# Altium schematic sheet schematic.SchDoc: <Project Name>
size A4; ENG_APP_DATE: --/--/--; DSN_APP_DATE: --/--/--; CHK_APP_DATE: --/--/--; Engineer: Engineer; Address4: Thành phố Hồ Chí Minh; DocumentNumber: 1; Revision: 1.0; SheetNumber: 1; SheetTotal: 1
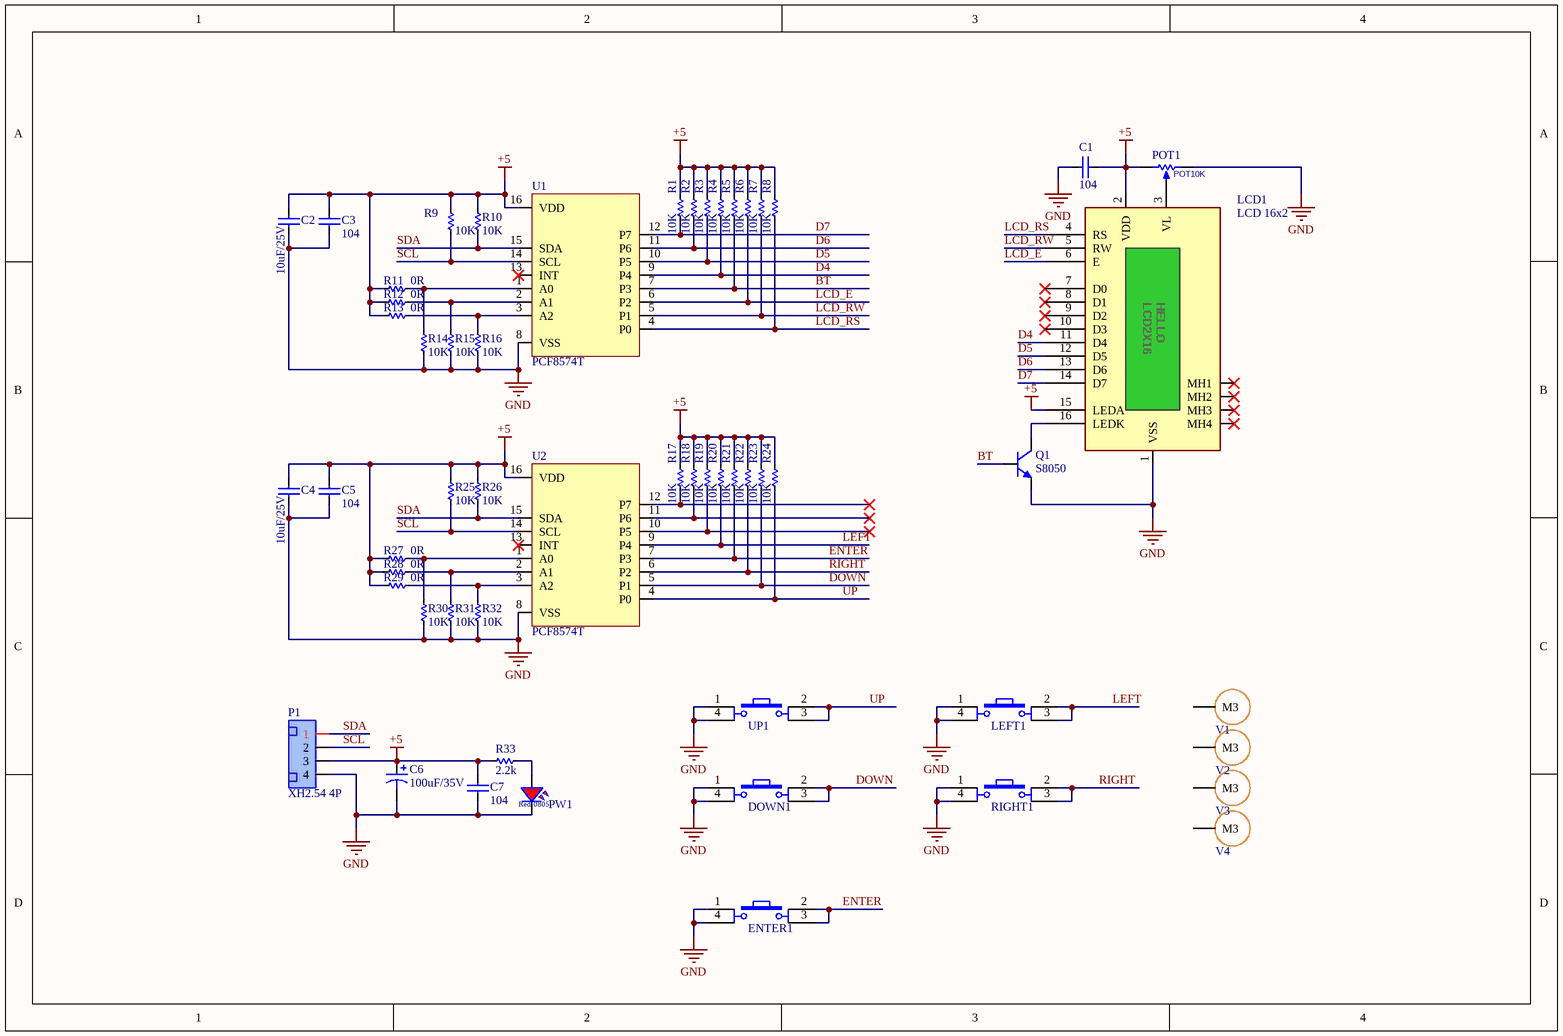
[diagram p0: schematic.SchDoc]

## Parts
C1  104  [C_0805_SMD]
C2  10uF/25V  [C_0805_SMD]
C3  104  [C_0805_SMD]
C4  10uF/25V  [C_0805_SMD]
C5  104  [C_0805_SMD]
C6  100uF/35V  [C_6.3x12]
C7  104  [C_0805_SMD]
DOWN1  SW4  [TSW DIP-12*12*17]  (value not drawn)
ENTER1  SW4  [TSW DIP-12*12*17]  (value not drawn)
LCD1  LCD 16x2  [LCD_16x2]
LEFT1  SW4  [TSW DIP-12*12*17]  (value not drawn)
P1  XH2.54 4P  [XH2.54_4P_RA]
POT1  POT10K  [POT_3362H]
PW1  LED RED  [LED 0805 Red]  (value not drawn)
Q1  S8050  [SOT23_N NXP]
R1  10K  [RES-SMD-0805]
R2  10K  [RES-SMD-0805]
R3  10K  [RES-SMD-0805]
R4  10K  [RES-SMD-0805]
R5  10K  [RES-SMD-0805]
R6  10K  [RES-SMD-0805]
R7  10K  [RES-SMD-0805]
R8  10K  [RES-SMD-0805]
R9  10K  [RES-SMD-0805]
R10  10K  [RES-SMD-0805]
R11  0R  [RES-SMD-0603]
R12  0R  [RES-SMD-0603]
R13  0R  [RES-SMD-0603]
R14  10K  [RES-SMD-0805]
R15  10K  [RES-SMD-0805]
R16  10K  [RES-SMD-0805]
R17  10K  [RES-SMD-0805]
R18  10K  [RES-SMD-0805]
R19  10K  [RES-SMD-0805]
R20  10K  [RES-SMD-0805]
R21  10K  [RES-SMD-0805]
R22  10K  [RES-SMD-0805]
R23  10K  [RES-SMD-0805]
R24  10K  [RES-SMD-0805]
R25  10K  [RES-SMD-0805]
R26  10K  [RES-SMD-0805]
R27  0R  [RES-SMD-0603]
R28  0R  [RES-SMD-0603]
R29  0R  [RES-SMD-0603]
R30  10K  [RES-SMD-0805]
R31  10K  [RES-SMD-0805]
R32  10K  [RES-SMD-0805]
R33  2.2k  [RES-SMD-0805]
RIGHT1  SW4  [TSW DIP-12*12*17]  (value not drawn)
U1  PCF8574T  [SO_16_W]
U2  PCF8574T  [SO_16_W]
UP1  SW4  [TSW DIP-12*12*17]  (value not drawn)
V1  Vit m3  [Screw M3x5 - Via]  (value not drawn)  (no BOM)
V2  Vit m3  [Screw M3x5 - Via]  (value not drawn)  (no BOM)
V3  Vit m3  [Screw M3x5 - Via]  (value not drawn)  (no BOM)
V4  Vit m3  [Screw M3x5 - Via]  (value not drawn)  (no BOM)

## Nets
+5: C1.1 C2.2 C3.2 C4.2 C5.2 C6.1 C7.2 LCD1.2(VDD) LCD1.15(LEDA) P1.3 POT1.1(TOP) R1.1 R2.1 R3.1 R4.1 R5.1 R6.1 R7.1 R8.1 R9.1 R10.1 R11.2 R12.2 R13.2 R17.1 R18.1 R19.1 R20.1 R21.1 R22.1 R23.1 R24.1 R25.1 R26.1 R27.2 R28.2 R29.2 R33.1 U1.16(VDD) U2.16(VDD)
GND: C1.2 C2.1 C3.1 C4.1 C5.1 C6.2 C7.1 DOWN1.1 DOWN1.4 ENTER1.1 ENTER1.4 LCD1.1(VSS) LEFT1.1 LEFT1.4 P1.4 POT1.3(BOT) PW1.2 Q1.2(E) R14.2 R15.2 R16.2 R30.2 R31.2 R32.2 RIGHT1.1 RIGHT1.4 U1.8(VSS) U2.8(VSS) UP1.1 UP1.4
BT: Q1.1(B) R5.2 U1.7(P3)
D4: LCD1.11(D4) R4.2 U1.9(P4)
D5: LCD1.12(D5) R3.2 U1.10(P5)
D6: LCD1.13(D6) R2.2 U1.11(P6)
D7: LCD1.14(D7) R1.2 U1.12(P7)
DOWN: DOWN1.2 DOWN1.3 R23.2 U2.5(P1)
ENTER: ENTER1.2 ENTER1.3 R21.2 U2.7(P3)
LCD_E: LCD1.6(E) R6.2 U1.6(P2)
LCD_RS: LCD1.4(RS) R8.2 U1.4(P0)
LCD_RW: LCD1.5(RW) R7.2 U1.5(P1)
LEFT: LEFT1.2 LEFT1.3 R20.2 U2.9(P4)
RIGHT: R22.2 RIGHT1.2 RIGHT1.3 U2.6(P2)
SCL: P1.2 R9.2 R25.2 U1.14(SCL) U2.14(SCL)
SDA: P1.1 R10.2 R26.2 U1.15(SDA) U2.15(SDA)
UP: R24.2 U2.4(P0) UP1.2 UP1.3
NetLCD1_3: LCD1.3(VL) POT1.2(TAP)
NetLCD1_16: LCD1.16(LEDK) Q1.3(C)
NetPW1_1: PW1.1 R33.2
NetR11_1: R11.1 R14.1 U1.1(A0)
NetR12_1: R12.1 R15.1 U1.2(A1)
NetR13_1: R13.1 R16.1 U1.3(A2)
NetR17_2: R17.2 U2.12(P7)
NetR18_2: R18.2 U2.11(P6)
NetR19_2: R19.2 U2.10(P5)
NetR27_1: R27.1 R30.1 U2.1(A0)
NetR28_1: R28.1 R31.1 U2.2(A1)
NetR29_1: R29.1 R32.1 U2.3(A2)

Not connected (* = marked no-connect by the designer): LCD1 7(D0)* 8(D1)* 9(D2)* 10(D3)* MH1* MH2* MH3* MH4*; U1 13(INT)*; U2 13(INT)*; V1 1(M3); V2 1(M3); V3 1(M3); V4 1(M3)

## Notes on the sheet
- Title
- Size:
- Date:
- A4
- Number:
- Time:
- Revision:
- Sheet
- of
- File:
- (in symbol LCD16x2 GREEN) LCD2X16; HELLO
- (in symbol LED 0805 RED) Red; 0805

## Library data of the parts
C1 C3 C5 C7 = Cap 0805 104 100nF: Cap SMD 0805 104-100nF-0.1uF 50V; Code: 1438-080
C2 C4 = Cap 0805 10uF 25V: Cap SMD 0805 10uF; Code: 1436-100
C6 = Cap Pol 100uF/35V: Polarized Capacitor (Axial) 100uF 35V; Code: 1402-225
DOWN1 ENTER1 LEFT1 RIGHT1 UP1 = SW4 DIP 12x12x17: Switch button 4 pin 12x12 DIP; Code: N/A
LCD1 = LCD16x2 GREEN: Code: 8300-012
P1 = XH2.54_4P_RA: XH2.54 RA; Code: 3509-012
POT1 = RES_THD_POT_3362H_10K: RESISTOR, THD, Potentiometer; Code: 1116-010; Designed by: TranLuyen
PW1 = LED 0805 RED: LED 0805 SMD RED; Code: 8600-017; Designed by: TranLuyen
Q1 = S8050 SOT-23: J3Y-NPN SMD Transistor SOT23; Code: 1701-070
R1-R10 R14-R26 R30-R32 = Res 10k 0805: Resistor SMD 0805; Code: 1024-111
R11-R13 R27-R29 = Res 0R 0603: Resistor SMD 0603; Code: 1028-001
R33 = Res 2.2K 0805: Resistor SMD 0805; Code: 1024-094
U1 U2 = PCF8574T: 16-SOIC, I2C 400kHz,Output Pull -1mA, Push 25mA, Input Pull_up -30=>-300uA; Code: 5007-031
V1-V4 = Screw Vit m3: Code: N/A